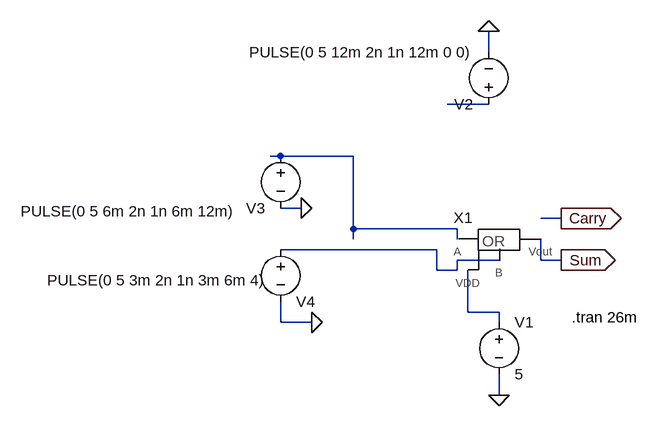
[diagram p0: schematic Simulating_OR.asc]
Simulating_OR.asc, the LTspice schematic file:
Version 4
SHEET 1 880 680
WIRE 80 -128 80 -160
WIRE 80 -48 16 -48
WIRE -240 32 -256 32
WIRE -128 32 -240 32
WIRE -208 112 -240 112
WIRE 192 128 160 128
WIRE -128 144 -128 32
WIRE 32 144 -128 144
WIRE -128 160 -128 144
WIRE 32 160 32 144
WIRE 0 176 -240 176
WIRE 96 192 32 192
WIRE 160 192 160 160
WIRE 192 192 160 192
WIRE 0 208 0 176
WIRE 32 208 32 192
WIRE 32 208 0 208
WIRE 48 272 48 208
WIRE 96 272 48 272
WIRE -240 288 -240 256
WIRE -192 288 -240 288
WIRE 96 288 96 272
WIRE 96 400 96 368
FLAG 80 -160 0
FLAG 96 400 0
FLAG -192 288 0
FLAG -208 112 0
FLAG 192 192 Sum
IOPIN 192 192 Out
FLAG 192 128 Carry
IOPIN 192 128 Out
SYMBOL voltage 96 272 R0
WINDOW 123 0 0 Left 2
WINDOW 39 0 0 Left 2
SYMATTR InstName V1
SYMATTR Value 5
SYMBOL voltage 80 -32 R180
WINDOW 123 0 0 Left 2
WINDOW 39 0 0 Left 2
SYMATTR InstName V2
SYMATTR Value PULSE(0 5 12m 2n 1n 12m 0 0)
SYMBOL voltage -240 16 M0
WINDOW 0 24 96 Left 2
WINDOW 3 69 101 Left 2
WINDOW 123 0 0 Left 2
WINDOW 39 0 0 Left 2
SYMATTR InstName V3
SYMATTR Value PULSE(0 5 6m 2n 1n 6m 12m)
SYMBOL voltage -240 160 R0
WINDOW 0 24 96 Left 2
WINDOW 3 -359 63 Left 2
WINDOW 123 0 0 Left 2
WINDOW 39 0 0 Left 2
SYMATTR InstName V4
SYMATTR Value PULSE(0 5 3m 2n 1n 3m 6m 4)
SYMBOL OR_gate 128 160 M180
SYMATTR InstName X1
TEXT 208 280 Left 2 !.tran 26m

The netlist it stands for:
* Simulating_OR.asc
V1 N004 0 5
V2 N001 0 PULSE(0 5 12m 2n 1n 12m 0 0)
V3 N002 0 PULSE(0 5 6m 2n 1n 6m 12m)
V4 N003 0 PULSE(0 5 3m 2n 1n 3m 6m 4)
XX1 N002 N003 Sum N004 OR_gate  ; pins A B Vout VDD
.tran 26m
.backanno
.end